# EAGLE design Mosfet Inverter (EAGLE 7.6.0)
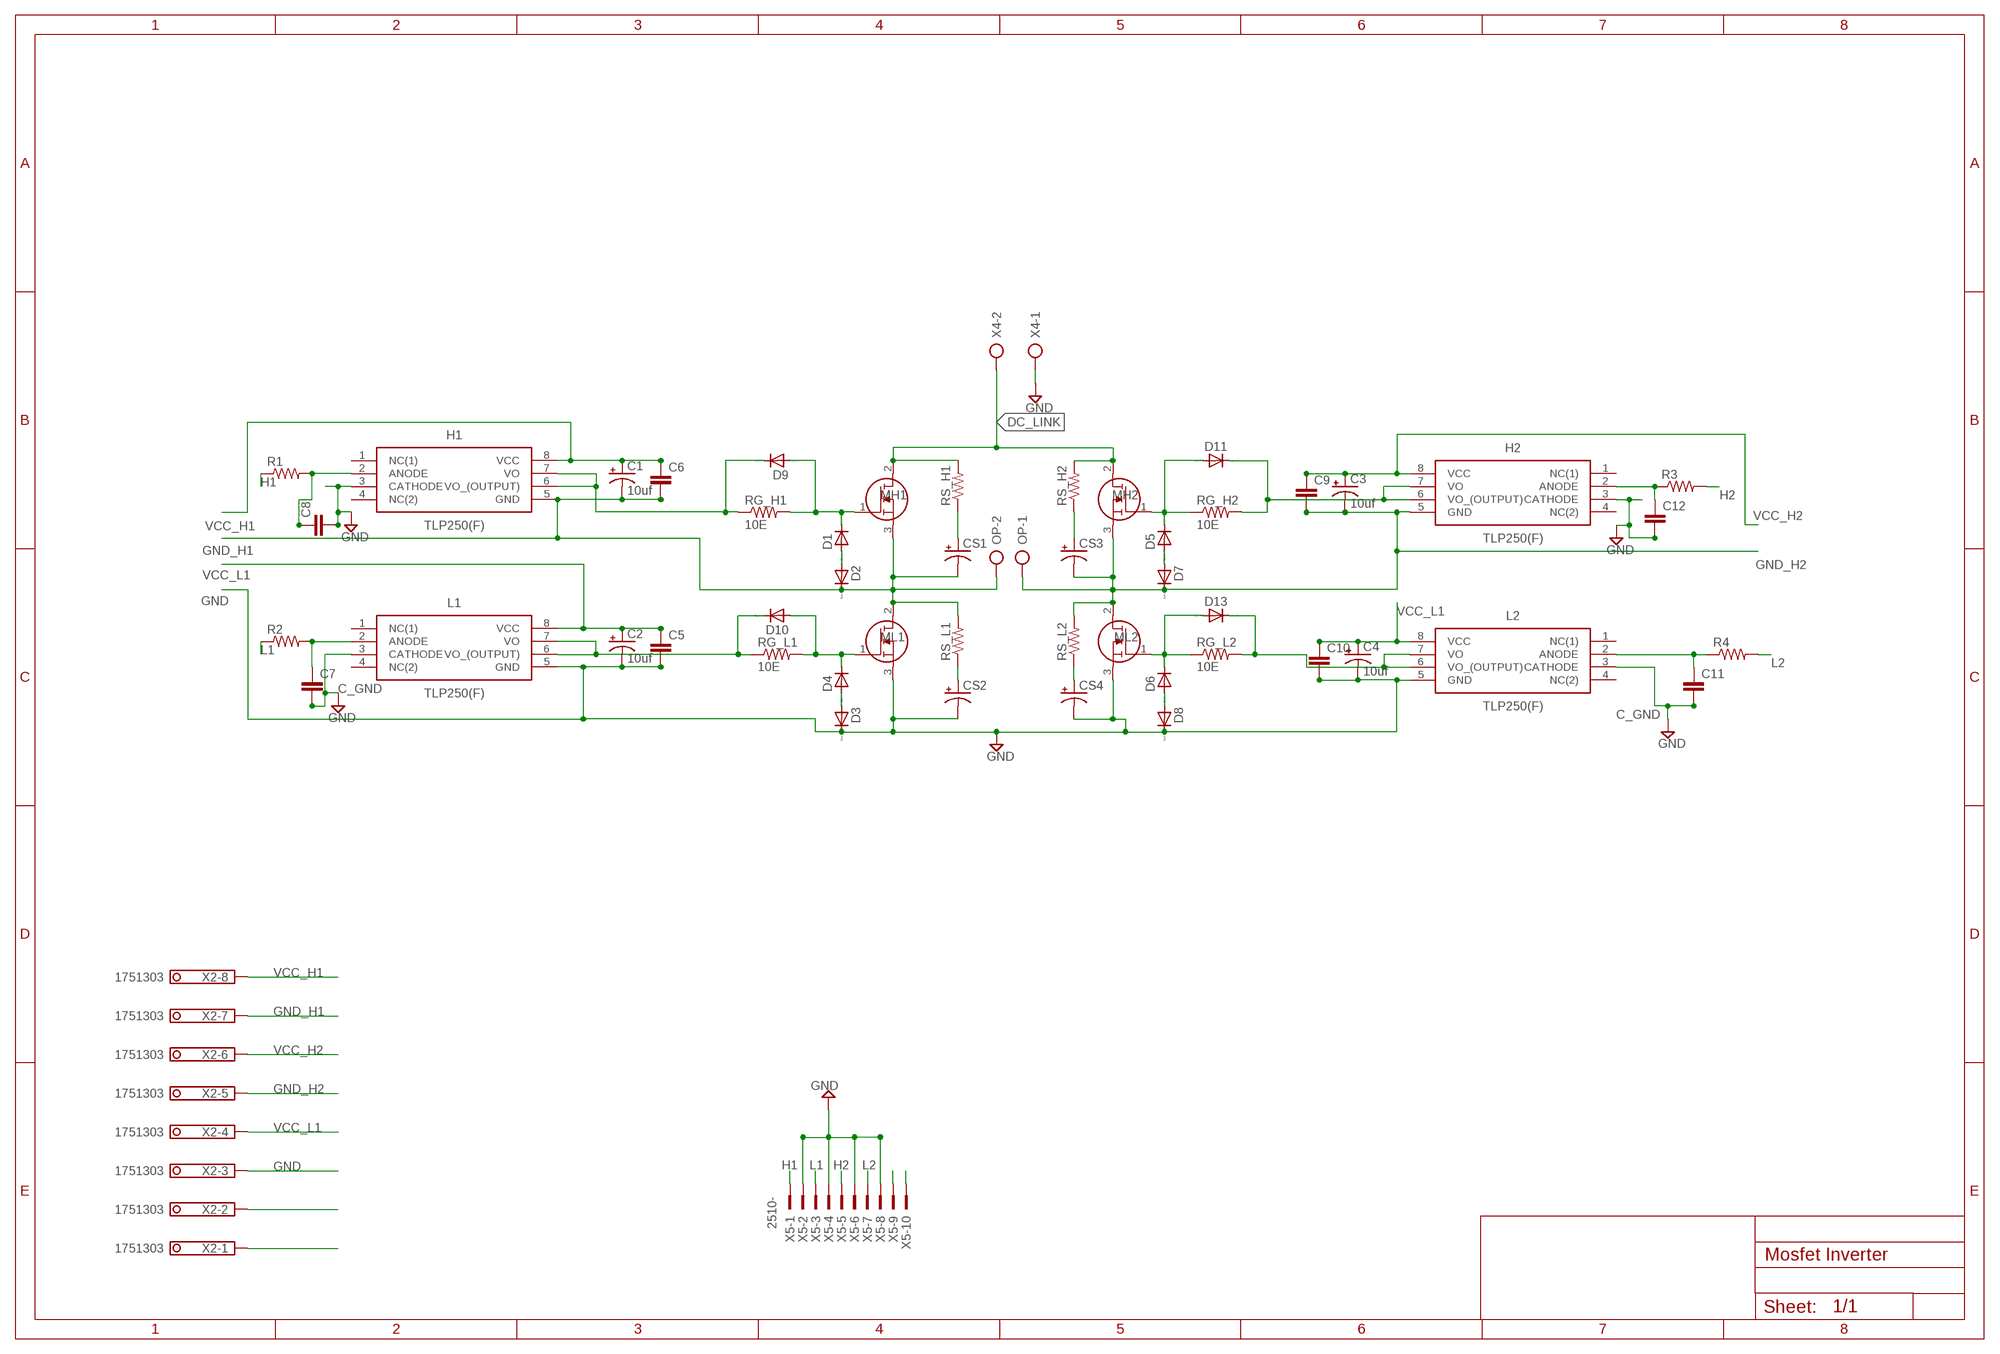
[diagram p0: schematic, sheet 1]

## Parts
C1  10uf  CPOL-USE2.5-5  [E2,5-5]
C2  10uf  CPOL-USE2.5-5  [E2,5-5]
C3  10uf  CPOL-USE2.5-5  [E2,5-5]
C4  10uf  CPOL-USE2.5-5  [E2,5-5]
C5  C-EUC1206K  [C1206K]
C6  C-EUC1206K  [C1206K]
C7  C-EUC1206K  [C1206K]
C8  C-EUC1206K  [C1206K]
C9  C-EUC1206K  [C1206K]
C10  C-EUC1206K  [C1206K]
C11  C-EUC1206K  [C1206K]
C12  C-EUC1206K  [C1206K]
CS1  CPOL-USE2.5-5  [E2,5-5]
CS2  CPOL-USE2.5-5  [E2,5-5]
CS3  CPOL-USE2.5-5  [E2,5-5]
CS4  CPOL-USE2.5-5  [E2,5-5]
D1  PMLL4150  [SOD80C]
D2  PMLL4150  [SOD80C]
D3  PMLL4150  [SOD80C]
D4  PMLL4150  [SOD80C]
D5  PMLL4150  [SOD80C]
D6  PMLL4150  [SOD80C]
D7  PMLL4150  [SOD80C]
D8  PMLL4150  [SOD80C]
D9  PMLL4150  [SOD80C]
D10  PMLL4150  [SOD80C]
D11  PMLL4150  [SOD80C]
D13  PMLL4150  [SOD80C]
H1  TLP250(F)  [DIP762W60P254L966H485Q8N]
H2  TLP250(F)  [DIP762W60P254L966H485Q8N]
L1  TLP250(F)  [DIP762W60P254L966H485Q8N]
L2  TLP250(F)  [DIP762W60P254L966H485Q8N]
MH1  RCX100N25  [TO254P480X1010X2060-3P]
MH2  RCX100N25  [TO254P480X1010X2060-3P]
ML1  RCX100N25  [TO254P480X1010X2060-3P]
ML2  RCX100N25  [TO254P480X1010X2060-3P]
OP  AK300/2  [AK300/2]
R1  R-US_R1206W  [R1206W]
R2  R-US_R1206W  [R1206W]
R3  R-US_R1206W  [R1206W]
R4  R-US_R1206W  [R1206W]
RG_H1  10E  R-US_R1206W  [R1206W]
RG_H2  10E  R-US_R1206W  [R1206W]
RG_L1  10E  R-US_R1206W  [R1206W]
RG_L2  10E  R-US_R1206W  [R1206W]
RS_H1  R-US_0207/15  [0207/15]
RS_H2  R-US_0207/15  [0207/15]
RS_L1  R-US_0207/15  [0207/15]
RS_L2  R-US_0207/15  [0207/15]
X2  1751303  [1751303]
X4  AK300/2  [AK300/2]
X5  2510-  [PAK100/2500-10]

## Nets
C_GND: C7.2 C8.2 C11.2 C12.2 H1.3(CATHODE) H2.3(CATHODE) L1.3(CATHODE) L2.3(CATHODE) X5.2 X5.4 X5.6 X5.8 ; supply symbol labelled GND
DC_LINK: MH1.2(DRAIN) MH2.2(DRAIN) RS_H1.2 RS_H2.2 X4.2
GND: C2.- C4.- C5.2 C10.2 CS2.- CS4.- D3.C D8.C L1.5(GND) L2.5(GND) ML1.3(SOURCE) ML2.3(SOURCE) X2.3 X4.1
GND_H1: C1.- C6.2 CS1.- D2.C H1.5(GND) MH1.3(SOURCE) ML1.2(DRAIN) OP.2 RS_L1.2 X2.7
GND_H2: C3.- C9.2 CS3.- D7.C H2.5(GND) MH2.3(SOURCE) ML2.2(DRAIN) OP.1 RS_L2.2 X2.5
H1: R1.1 X5.1
H2: R3.2 X5.5
L1: R2.1 X5.3
L2: R4.2 X5.7
N$1: CS1.+ RS_H1.1
N$2: D11.C H2.6(VO_(OUTPUT)) H2.7(VO) RG_H2.2
N$4: C7.1 L1.2(ANODE) R2.2
N$6: CS3.+ RS_H2.1
N$7: CS4.+ RS_L2.1
N$8: C8.1 H1.2(ANODE) R1.2
N$9: CS2.+ RS_L1.1
N$10: D5.A D7.A
N$11: D6.A D8.A
N$12: D1.C D9.A MH1.1(GATE) RG_H1.2
N$13: D1.A D2.A
N$14: D13.C L2.6(VO_(OUTPUT)) L2.7(VO) RG_L2.2
N$15: D3.A D4.A
N$16: D4.C D10.A ML1.1(GATE) RG_L1.2
N$17: D6.C D13.A ML2.1(GATE) RG_L2.1
N$18: D5.C D11.A MH2.1(GATE) RG_H2.1
N$20: D9.C H1.6(VO_(OUTPUT)) H1.7(VO) RG_H1.1
N$21: D10.C L1.6(VO_(OUTPUT)) L1.7(VO) RG_L1.1
N$23: C12.1 H2.2(ANODE) R3.1
N$24: C11.1 L2.2(ANODE) R4.1
N$27: X2.2
N$28: X2.1
N$31: X5.9
N$32: X5.10
VCC_H1: C1.+ C6.1 H1.8(VCC) X2.8
VCC_H2: C3.+ C9.1 H2.8(VCC) X2.6
VCC_L1: C2.+ C4.+ C5.1 C10.1 L1.8(VCC) L2.8(VCC) X2.4
Unconnected: H1.1(NC(1)) H1.4(NC(2)) H2.1(NC(1)) H2.4(NC(2)) L1.1(NC(1)) L1.4(NC(2)) L2.1(NC(1)) L2.4(NC(2))

## Library data of the parts
C1-C4 CS1-CS4 = rcl:CPOL-US: POLARIZED CAPACITOR, American symbol
C5-C12 = rcl:C-EU: CAPACITOR, European symbol
D1-D11 D13 = diode:PMLL4150: DIODE high speed
H1 H2 L1 L2 = TLP250(F):TLP250(F): MOSFET drive opto-isolator,TLP250(F) Toshiba TLP250(F) DC Input Transistor Output Optocoupler, Through Hole, 8-Pin PDIP <https://componentsearchengine.com/Images/3/TLP250%28F%29.jpg> Source: Datasheet <https://toshiba.semicon-storage.com/info/docget.jsp?did=16821&prodName=TLP250>; DESCRIPTION: MOSFET drive opto-isolator,TLP250(F) Toshiba TLP250(F) DC Input Transistor Output Optocoupler, Through Hole, 8-Pin PDIP; DIGIKEY_PART_NUMBER: TLP250(F)-ND; HEIGHT: 4.85mm; MANUFACTURER_NAME: Toshiba; MANUFACTURER_PART_NUMBER: TLP250(F); SUPPLIER_NAME: DigiKey
MH1 MH2 ML1 ML2 = RCX100N25:RCX100N25: MOSFET Nch 250V 10A MOSFET <https://componentsearchengine.com/Images/1/RCX100N25.jpg> Source: Datasheet <https://componentsearchengine.com/Datasheets/1/RCX100N25.pdf>; DESCRIPTION: MOSFET Nch 250V 10A MOSFET; HEIGHT: 4.8mm; MANUFACTURER_NAME: ROHM Semiconductor; MANUFACTURER_PART_NUMBER: RCX100N25; MOUSER_PART_NUMBER: 755-RCX100N25; SUPPLIER_NAME: Mouser
OP X4 = con-ptr500:AK300/2: CONNECTOR; OC_FARNELL: unknown; OC_NEWARK: unknown
R1-R4 = rcl:R-US_: RESISTOR, American symbol
RG_H1 RG_H2 RG_L1 RG_L2 RS_H1 RS_H2 RS_L1 RS_L2 = resistor:R-US_: RESISTOR, American symbol
X2 = con-phoenix-350:1751303: MKDS 1/ 8-3,5 Printklemme Nennstrom: 10 A Bemessungsspannung: 160 V Raster: 3,5 mm Polzahl: 8 Montageart: Löten Anschlussart: Schraubanschluss Anschlussrichtung vom Leiter zur Platine: 0° Source: http://eshop.phoenixcontact.com .. .pdf; OC_FARNELL: unknown; OC_NEWARK: unknown
X5 = con-3m:2510-: 3M (TM) Pak 100 4-Wall Header Source: 3M; MF: 3M; MPN: 2510-6002UB; OC_FARNELL: 9838244; OC_NEWARK: 46F4725

## Board
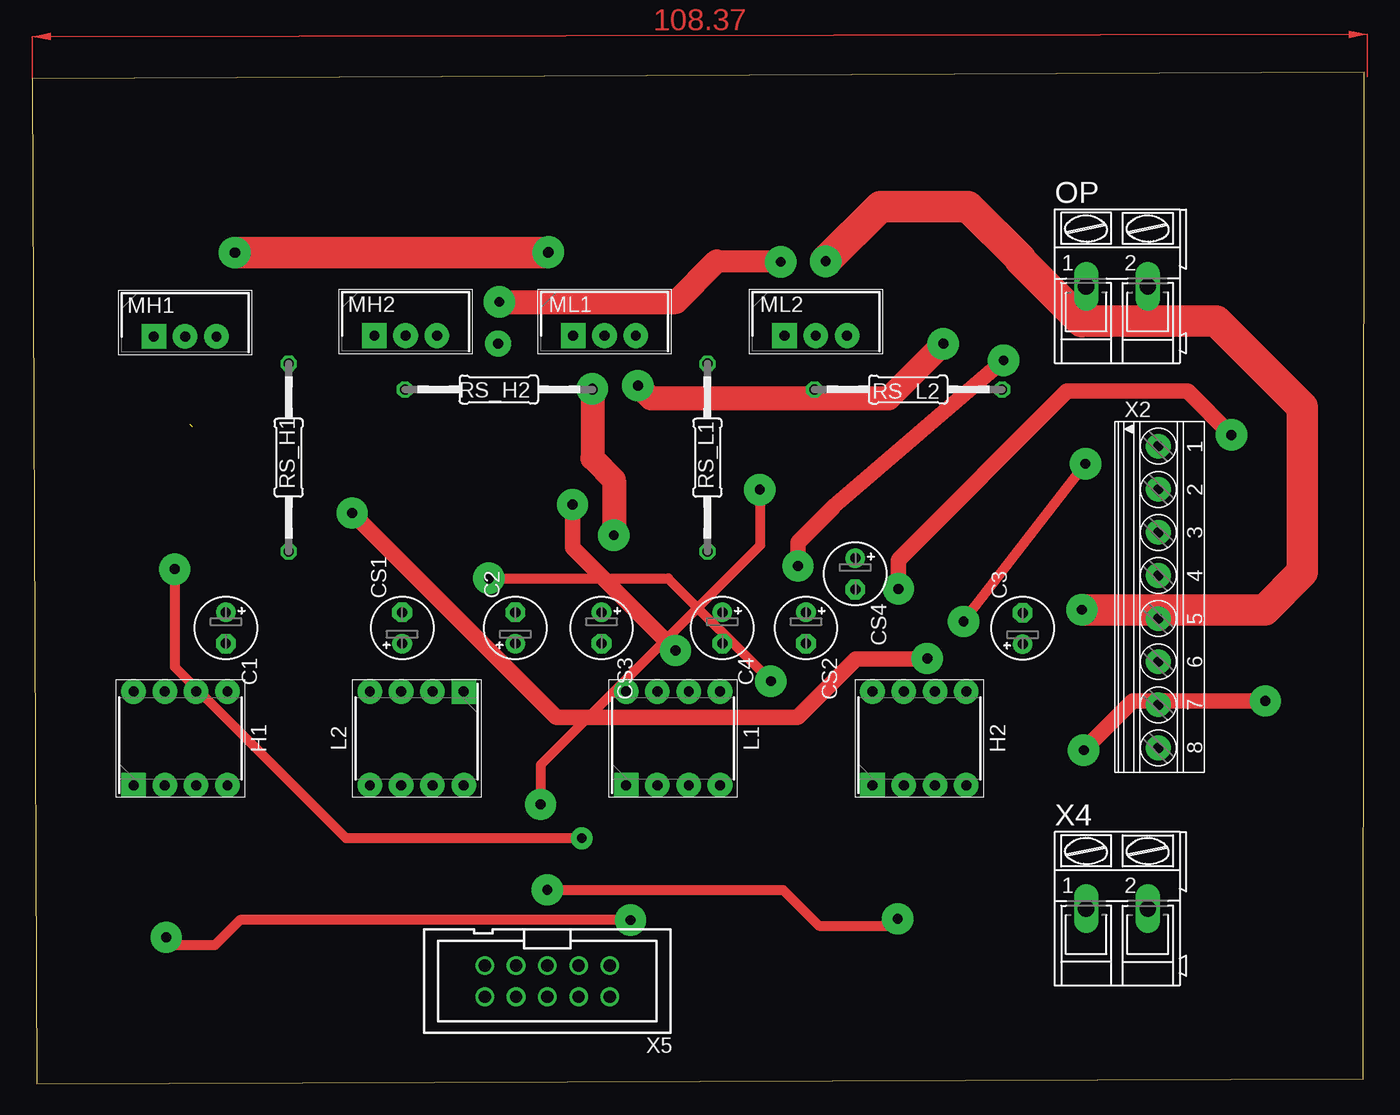
[diagram p1: board, top side]
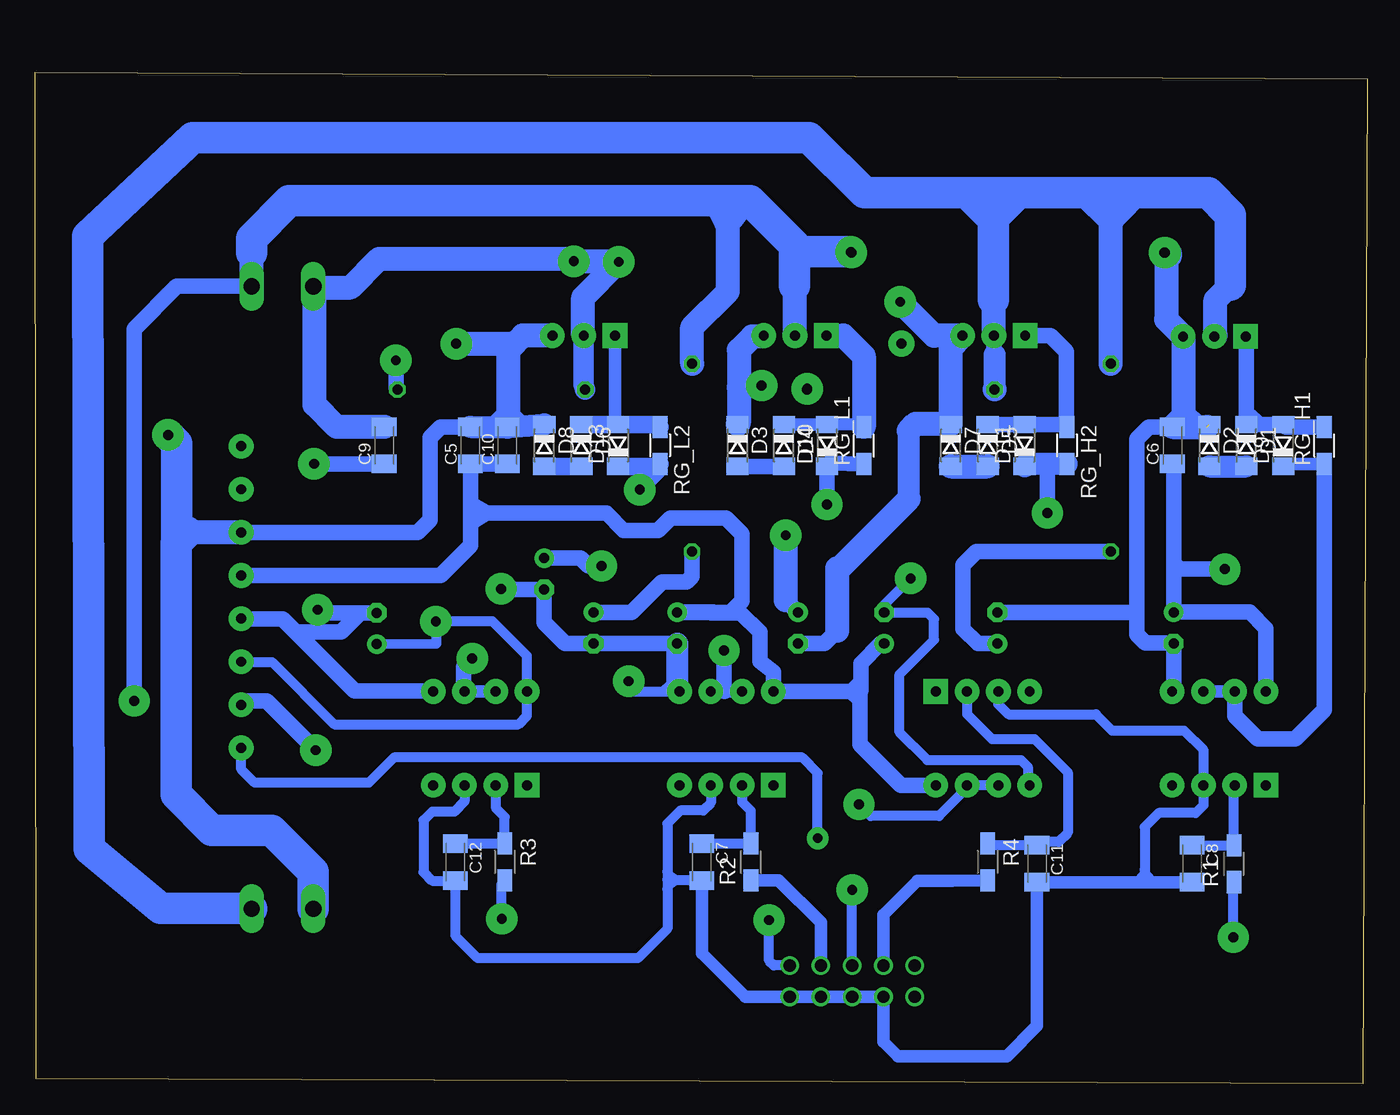
[diagram p2: board, bottom side, seen from below]

Size 108.12 x 82.16 mm. Coordinates in mm from the lower left corner, seen from the top.
Outline: 0.33,0 108.07,0.41 108.12,82.16 0,81.63 0.33,0
Copper layers (1*16): Top 0.035mm / dielectric 1.5mm / Bottom 0.035mm
Design rules "default": minimum track width 10mil, minimum drill 24mil, track to track 8mil, track to pad 8mil, pad to pad 8mil, via to via 8mil, smd to smd 8mil, copper to edge 40mil, drill to drill 8mil, minimum pad ring 10mil, minimum via ring 8mil, stop-mask expansion 4mil, vias tented up to drill 0mil, thermal gap 10mil

### Footprints (pad centres in the part's own frame; a part is rotated, then mirrored left to right if it is on the bottom)
E2,5-5 = drill 0.813 pad 1.6: + -1.27,0 | drill 0.813 pad 1.6 octagon: - 1.27,0
C1206K = smd 1.5 x 2: 1 -1.5,0; 2 1.5,0
SOD80C = smd 1.4 x 1.8: A 1.7,0; C -1.7,0
DIP762W60P254L966H485Q8N = drill 0.8 pad 2 square: 1 -3.81,3.81 | drill 0.8 pad 2: 2 -3.81,1.27; 3 -3.81,-1.27; 4 -3.81,-3.81; 5 3.81,-3.81; 6 3.81,-1.27; 7 3.81,1.27; 8 3.81,3.81
TO254P480X1010X2060-3P = drill 0.8 pad 2 square: 1 0,0 | drill 0.8 pad 2: 2 2.54,0; 3 5.08,0
AK300/2 = drill 1.321 long: 1 -2.515,0; 2 2.489,0
R1206W = smd 1.8 x 1.2: 1 -1.499,0; 2 1.499,0
0207/15 = drill 0.813 octagon: 1 -7.62,0; 2 7.62,0
1751303 = drill 0.8 pad 2: 1 -12.25,-0.1; 2 -8.75,-0.1; 3 -5.25,-0.1; 4 -1.75,-0.1; 5 1.75,-0.1; 6 5.25,-0.1; 7 8.75,-0.1; 8 12.25,-0.1
PAK100/2500-10 = drill 1 pad 1.422: 1 -5.08,-1.27; 2 -5.08,1.27; 3 -2.54,-1.27; 4 -2.54,1.27; 5 0,-1.27; 6 0,1.27; 7 2.54,-1.27; 8 2.54,1.27; 9 5.08,-1.27; 10 5.08,1.27

### Placement (x,y rotation side)
C1  15.71,37.03 270 top
C2  39.21,37.03 90 top
C3  80.41,36.99 90 top
C4  56.02,37.03 270 top
C5  72.81,51.85 90 bottom
C6  15.81,51.85 90 bottom
C7  54.02,18.03 270 bottom
C8  14.21,17.89 270 bottom
C9  79.81,51.85 90 bottom
C10  69.81,51.85 90 bottom
C11  26.81,17.89 270 bottom
C12  74.02,18.03 270 bottom
CS1  30.02,37.03 90 top
CS2  62.81,37.03 270 top
CS3  46.21,37.03 270 top
CS4  66.81,41.43 270 top
D1  9.81,51.85 270 bottom
D2  12.81,51.85 270 bottom
D3  51.11,51.85 270 bottom
D4  47.36,51.85 270 bottom
D5  30.81,51.85 270 bottom
D6  63.81,51.85 270 bottom
D7  33.81,51.85 270 bottom
D8  66.81,51.85 270 bottom
D9  6.81,51.85 90 bottom
D10  43.86,51.85 90 bottom
D11  27.81,51.85 90 bottom
D13  60.81,51.85 90 bottom
H1  12.02,28.07 90 top
H2  72.02,28.07 90 top
L1  52.02,28.07 90 top
L2  31.21,28.07 270 top
MH1  9.85,60.7 0 top
MH2  27.76,60.78 0 top
ML1  43.91,60.78 0 top
ML2  61.06,60.78 0 top
OP  88.08,64.78 0 top
R1  10.81,17.89 90 bottom
R2  50.02,18.03 90 bottom
R3  70.02,18.03 270 bottom
R4  30.81,18.03 270 bottom
RG_H1  3.47,51.85 90 bottom
RG_H2  24.38,51.85 270 bottom
RG_L1  40.86,51.85 90 bottom
RG_L2  57.42,51.85 270 bottom
RS_H1  20.81,50.86 90 top
RS_H2  37.87,56.39 180 top
RS_L1  54.81,50.86 90 top
RS_L2  71.11,56.39 180 top
X2  91.52,39.54 270 top
X4  88.08,14.23 0 top
X5  41.81,8.35 180 top

### Tracks (layer width: path | path; a pad name or v marks a point on that pad's centre or on a via)
C_GND
  Bottom 0.406: 55.81,16.61 56.81,17.26 | 56.01,16.41 56.81,15.81 | 18.06,17.41 18.86,16.46
  Bottom 0.813: H2.3 73.29,22.93 74.11,22.11 75.91,22.11 76.61,21.41 76.61,17.21 75.91,16.51 74.04,16.51 C12.2 74.01,12.01 72.21,10.21 59.21,10.21 56.81,12.61 56.81,15.81 56.81,16.61 | L1.3 53.29,22.83 53.91,22.21 55.76,22.21 56.81,21.16 56.81,17.26 56.81,16.61 | C7.2 54.05,16.56 56.76,16.56 56.81,16.61 | 18.01,16.39 18.06,16.44 18.06,17.41 18.06,20.86 16.91,22.01 13.91,22.01 13.29,22.63 H1.3 13.31,24.28 13.31,27.16 14.86,28.71 20.71,28.71 22.01,30.01 29.11,30.01 29.94,30.84 L2.3
  Bottom 1.016: C7.2 54.02,10.62 50.46,7.06 46.9,7.06 X5.2 X5.4 X5.6 X5.8 39.27,3.42 38.11,2.26 29.26,2.26 26.81,4.71 C11.2 18.01,16.39 C8.2
DC_LINK
  Bottom 1.016: 30.36,70.16 30.76,70.16
  Bottom 1.27: MH2.2 30.3,59.26 30.26,59.21 | 20.81,69.56 18.71,71.76
  Bottom 1.778: 30.26,59.21 30.26,56.4
  Bottom 1.93: MH1.2 12.31,60.79 12.31,63.66 11.11,64.86 | 30.26,56.4 RS_H2.2 | MH2.2 30.3,63.66 30.36,63.71 | RS_H1.2 20.81,69.56 20.81,72.36
  Bottom 2.54: X4.2 90.6,14.26 97.96,14.26 103.76,19.11 103.86,68.86 95.36,76.86 45.31,76.86 40.81,72.36 31.01,72.36 | 30.36,63.71 30.36,70.16 30.36,71.71 31.01,72.36 | 21.71,72.36 20.81,72.36 12.91,72.36 11.11,70.56 11.11,64.86 | 21.71,72.36 31.01,72.36 | 21.71,72.36 21.71,71.96 21.76,71.91 21.76,71.61
GND  (via drill 0.8 pad 2.54)
  Top 0.813: v37.06,41.06 51.61,41.06 v59.96,32.71
  Top 1.27: v70.31,40.21 70.31,42.56 84.01,56.26 93.81,56.26 v97.36,52.71
  Top 1.93: v49.16,56.71 50.21,55.66 69.51,55.66 v73.96,60.11
  Bottom 0.813: L2.5 27.56,24.42 27.56,25.76 28.11,26.31 35.71,26.31 37.96,28.56 37.96,33.26 35.16,36.06 35.16,37.76 35.66,38.26 39.17,38.26 C2.- 39.21,38.91 v37.06,41.06 | v59.96,32.71 59.96,32.36 59.46,31.86 55.84,31.86 L1.5
  Bottom 1.27: C4.- CS2.- 65.11,35.76 66.81,37.46 CS4.- 70.25,40.16 v70.31,40.21 | X2.3 77.08,44.79 76.06,45.81 76.06,52.51 75.21,53.36 C5.2
  Bottom 1.778: C4.- 56.02,32.07 L1.5 | C5.2 C10.2 D8.C
  Bottom 1.93: ML1.3 49.06,60.71 49.91,60.71 51.01,59.61 51.01,56.56 | 95.81,44.81 91.44,44.81 X2.3 | 51.01,56.56 51.01,53.65 D3.C | v49.16,56.71 50.86,56.71 51.01,56.56 | ML2.3 68.54,60.78 69.21,60.11 | 69.21,60.11 69.76,59.56 69.76,53.4 C10.2 | v73.96,60.11 69.21,60.11
  Bottom 2.54: X4.1 85.56,17.21 88.96,20.61 93.81,20.61 96.71,23.51 96.71,43.61 | 96.71,43.61 96.71,43.91 95.81,44.81 | 96.71,43.61 96.66,43.66 96.66,52.01 v97.36,52.71
GND_H1  (via drill 0.8 pad 2.54)  (1 unrouted)
  Top 1.27: v100.11,31.11 89.36,31.11 v85.36,27.11
  Top 2.54: v41.86,67.51 v16.46,67.51
  Bottom 1.27: H1.5 15.71,32 C1.- 15.76,35.81 18.01,35.81 18.71,36.51 18.71,38.36 | C6.2 17.71,53.35 18.71,52.36 18.71,38.36 | CS1.- 18.77,38.3 18.71,38.36 | OP.2 96.64,64.78 100.11,61.31 v100.11,31.11 | v85.36,27.11 89.36,31.11 91.1,31.11 X2.7
  Bottom 1.93: OP.2 90.57,67.5 | 46.51,64.81 46.51,60.84 ML1.2 46.45,67.55 46.51,67.61 | 13.01,53.35 C6.2 14.93,54.23 MH1.3 16.31,62.07 16.31,67.36 | RS_L1.2 54.81,61.46 51.91,64.36 51.91,71.56 52.06,71.71 | OP.2 90.57,68.22 90.71,68.36 | OP.2 90.57,68.55 90.31,68.81
  Bottom 2.54: 90.57,67.5 90.57,68.65 87.51,71.71 52.06,71.71 50.11,71.71 46.51,68.11 46.51,67.61 | 46.51,67.61 46.51,64.81 | 46.51,67.61 41.96,67.61 v41.86,67.51 | v16.46,67.51 16.31,67.36
GND_H2  (via drill 0.8 pad 2.54)
  Top 1.778: 55.56,66.81 60.71,66.81 v60.76,66.76
  Top 1.93: v37.91,63.51 52.26,63.51 55.56,66.81
  Top 2.54: v64.41,66.81 68.86,71.26 75.96,71.26 80.21,67.01 80.21,66.91 85.21,61.91 85.26,61.96 96.11,61.96 103.11,54.96 103.11,41.56 100.06,38.51 v85.21,38.51
  Bottom 1.27: CS3.- 44.06,35.76 43.01,36.81 | 91.4,37.81 X2.5 91.39,37.76 88.06,37.76 87.01,36.71 | 87.01,36.71 82.21,31.91 75.86,31.91 H2.5 | 87.01,36.71 83.31,36.71 81.75,38.26 C3.- 84.96,38.26 v85.21,38.51
  Bottom 1.676: ML2.2 63.6,56.81 RS_L2.2
  Bottom 1.778: 37.21,47.51 37.21,53.06 | 63.66,60.83 ML2.2
  Bottom 1.93: ML2.2 | 43.01,36.81 43.01,41.86 42.86,41.86 37.21,47.51 | 37.21,53.06 36.66,53.61 33.86,53.61 D7.C 33.81,59.81 32.86,60.76 | 32.86,60.76 MH2.3 | 32.86,60.76 35.16,60.76 v37.91,63.51 | C9.2 83.65,53.35 85.46,55.16 85.46,64.67 | 85.46,64.67 OP.1 | 85.46,64.67 82.54,64.67 80.21,67.01 64.61,67.01 v64.41,66.81 60.81,66.81 v60.76,66.76 63.66,63.86 63.66,60.83
H1  (via drill 0.8 pad 2.54)
  Top 0.813: v48.56,13.31 16.86,13.31 14.81,11.26 11.51,11.26 v10.86,11.91
  Bottom 0.813: v10.86,11.91 10.86,16.91 R1.1 | X5.1 48.16,9.62 48.56,10.01 v48.56,13.31
H2  (via drill 0.8 pad 2.54)
  Top 0.813: v41.81,15.76 60.96,15.76 63.86,12.86 69.71,12.86 v70.26,13.41
  Bottom 0.813: X5.5 v41.81,15.76 | v70.26,13.41 70.26,16.29 R3.2
L1
  Bottom 1.016: R2.1 47.78,16.53 44.36,13.11 X5.3
L2
  Bottom 1.016: X5.7 39.27,13.75 36.51,16.51 33.73,16.51 R4.2
N$1
  Bottom 1.27: CS1.+ 31.61,35.76 32.81,36.96 32.81,42.16 31.73,43.24 RS_H1.1
N$2  (via drill 0.8 pad 2.54)
  Top 1.27: v25.96,46.36 42.56,29.76 62.11,29.76 66.86,34.51 72.61,34.51 v72.66,34.56
  Bottom 0.813: H2.7 73.27,31.88 73.36,31.96
  Bottom 1.016: H2.6 H2.7
  Bottom 1.27: 73.36,31.96 73.36,33.86 v72.66,34.56 | v25.96,46.36 25.96,49.9 26.41,50.35
  Bottom 1.778: RG_H2.2 26.41,50.35 27.61,50.35 D11.C
N$4
  Bottom 0.813: C7.1 R2.2 50.06,19.57 50.06,22.21 50.75,22.9 L1.2
N$6  (via drill 0.8 pad 2.54)
  Top 1.93: v45.46,56.46 45.46,50.81 47.21,49.06 v47.21,44.56
  Bottom 1.27: 47.21,39.3 CS3.+
  Bottom 1.93: RS_H2.1 45.49,56.43 v45.46,56.46 | v47.21,44.56 47.21,39.3
N$7  (via drill 0.8 pad 2.54)
  Top 1.27: v62.16,42.06 62.16,43.96 65.06,46.86 65.06,46.91 v78.86,58.76
  Bottom 1.27: CS4.+ 63.84,42.7 63.21,42.06 v62.16,42.06 | v78.86,58.76 78.86,56.52 RS_L2.1
N$8
  Bottom 0.813: R1.2 10.81,24.2 H1.2 | 10.81,19.96 R1.2 | C8.1 R1.2
N$9
  Bottom 1.27: CS2.+ 59.72,38.3 57.26,40.76 55.26,40.76 54.81,41.21 RS_L1.1
N$10
  Bottom 1.93: D7.A D5.A
N$11
  Bottom 1.422: D8.A D6.A
N$12
  Bottom 1.27: RG_H1.2 6.61,53.35 D9.A D1.C 9.81,60.65 MH1.1
N$13
  Bottom 1.778: D2.A D1.A
N$14  (via drill 0.8 pad 2.54)
  Top 0.813: v59.06,48.26 59.11,48.21 59.11,43.76 41.26,25.91 v41.26,22.71
  Bottom 0.813: L2.6 L2.7 32.48,24.04 34.76,21.76 40.31,21.76 v41.26,22.71 | v59.06,48.26 59.06,48.71 RG_L2.2
  Bottom 1.27: 57.62,50.15 57.62,49.7 v59.06,48.26
  Bottom 1.422: D13.C 57.62,50.15 RG_L2.2
N$15
  Bottom 1.27: D4.A D3.A
N$16
  Bottom 1.016: D4.C D10.A 41.06,53.6 RG_L1.2
  Bottom 1.93: ML1.1 42.52,60.78 40.86,59.11 RG_L1.2
N$17
  Bottom 1.016: ML2.1 61.06,53.81 D13.A
  Bottom 1.422: D6.C D13.A 57.62,53.55 RG_L2.1
N$18
  Bottom 1.27: 27.76,53.6 D11.A | D5.C D11.A | D11.A 24.58,53.55 RG_H2.1 24.41,53.38 24.41,59.46 25.72,60.78 MH2.1
N$20
  Bottom 1.016: RG_H1.1 6.61,50.35 D9.C | H1.6 H1.7
  Bottom 1.27: H1.7 10.75,29.9 8.86,28.01 5.81,28.01 3.46,30.36 RG_H1.1
N$21  (via drill 0.8 pad 2.54)
  Top 1.27: v43.86,47.06 43.86,43.56 v52.21,35.21
  Bottom 1.016: L1.6 52.16,31.88 L1.7
  Bottom 1.27: RG_L1.1 43.66,50.4 D10.C v43.86,47.06 | v52.21,35.21 52.21,31.93 52.16,31.88
N$23
  Bottom 0.813: C12.1 R3.1 70.02,21.67 70.71,22.36 70.71,24.22 H2.2
N$24
  Bottom 0.813: L2.2 32.48,30.03 30.46,28.01 27.01,28.01 24.31,25.31 24.31,20.41 25.06,19.66 26.54,19.66 C11.1 30.67,19.39 R4.1
N$34
  Bottom 1.422: 69.61,55.31 69.61,54.71
N$35
  Bottom 1.016: 69.86,55.11 69.86,54.86 71.21,53.51
N$36
  Bottom 1.016: 69.66,55.66 69.66,54.86 68.56,53.76
N$37
  Bottom 1.27: 15.01,54.76 13.56,53.56
N$38
  Bottom 1.27: 9.71,54.46 9.06,53.86
N$43
  Bottom 0.813: 42.16,31.91 41.26,32.81
N$44
  Bottom 0.813: 42.36,31.76 42.11,31.76 41.36,31.01
N$47
  Bottom 1.016: 30.41,69.81 30.31,69.81
N$50
  Bottom 1.27: 30.46,69.61 30.61,69.61 33.01,72.01
N$51
  Bottom 1.27: 30.51,69.16 30.51,69.31 27.96,71.86
N$58
  Bottom 1.27: 21.06,69.71 21.06,69.86 23.11,71.91
N$65
  Bottom 1.27: 51.31,70.01 50.66,70.86
N$66  (via drill 0.8 pad 2.54)
  other vias: 16.41,67.51
N$67  (via drill 0.8 pad 2.54)
  other vias: 41.91,67.56
N$73
  Bottom 1.27: 52.36,69.81 52.86,70.81
N$77
  Bottom 0.813: 71.71,46.16 72.76,46.96
N$78
  Bottom 0.406: 18.11,17.46 17.36,16.61
N$79
  Bottom 0.813: 71.16,46.46 72.66,47.31
N$80
  Bottom 0.813: 71.01,46.41 72.86,45.21
N$81
  Bottom 0.406: 57.36,32.01 56.61,32.66
N$82  (via drill 0.8 pad 2.1)
  other vias: 37.81,60.11
VCC_H1  (via drill 0.8 pad 1.78, 0.8 pad 2.54)
  Top 0.813: v44.61,19.96 25.46,19.96 11.56,33.86 v11.56,41.81
  Bottom 0.813: v44.61,19.96 44.61,25.26 45.86,26.51 79.01,26.51 81.06,24.46 90.31,24.46 91.41,25.56 X2.8
  Bottom 1.27: H1.8 8.21,37.01 9.51,38.31 C1.+ 15.71,42.26 | 15.71,42.26 15.71,50.25 C6.1 | v11.56,41.81 15.26,41.81 15.71,42.26
VCC_H2  (via drill 0.8 pad 2.54)
  Top 0.813: v75.61,37.56 v85.51,50.36
  Bottom 0.813: 80.39,35.71 C3.+ 75.56,35.76 v75.61,37.56 71.01,37.56 68.21,34.76 H2.8 68.21,29.91 68.91,29.21 83.86,29.21 88.91,34.26 91.39,34.26
  Bottom 1.27: 91.39,34.26 X2.6 | v85.51,50.36 C9.1
VCC_L1
  Bottom 1.016: L1.8 48.21,33.46 | C4.+
  Bottom 1.27: L2.8 37.85,24.26 41.16,27.56 41.16,31.66 | 41.16,31.66 41.16,31.91 41.11,31.96 41.11,34.16 39.51,35.76 C2.+ | 41.16,31.66 41.36,31.86 48.16,31.86 48.21,31.91 48.21,33.46 49.31,34.31 49.31,36.71 50.86,38.26 53.27,38.26 53.31,38.3 | C10.1 C5.1 72.81,46.01 | 53.06,38.31 C4.+ | 72.81,46.01 72.81,43.71 75.21,41.31 91.4,41.31 X2.4 | C4.+ 53.31,38.3 | 53.31,38.3 51.67,38.3 50.76,39.21 50.76,44.66 52.06,45.96 56.56,45.96 57.56,44.96 60.36,44.96 61.76,46.36 72.36,46.36 72.76,45.96 72.81,46.01
(copper drawn outside any net)
  shapes: Top area x2